# EasyEDA schematic SCH_Wack-a-Mole_2025-09-20.json
TITLE: Sheet_1; REV: 1.0; Date: 2025-09-12; Sheet: 1/1; Drawn By: ofer.afik123; Company: Your Company
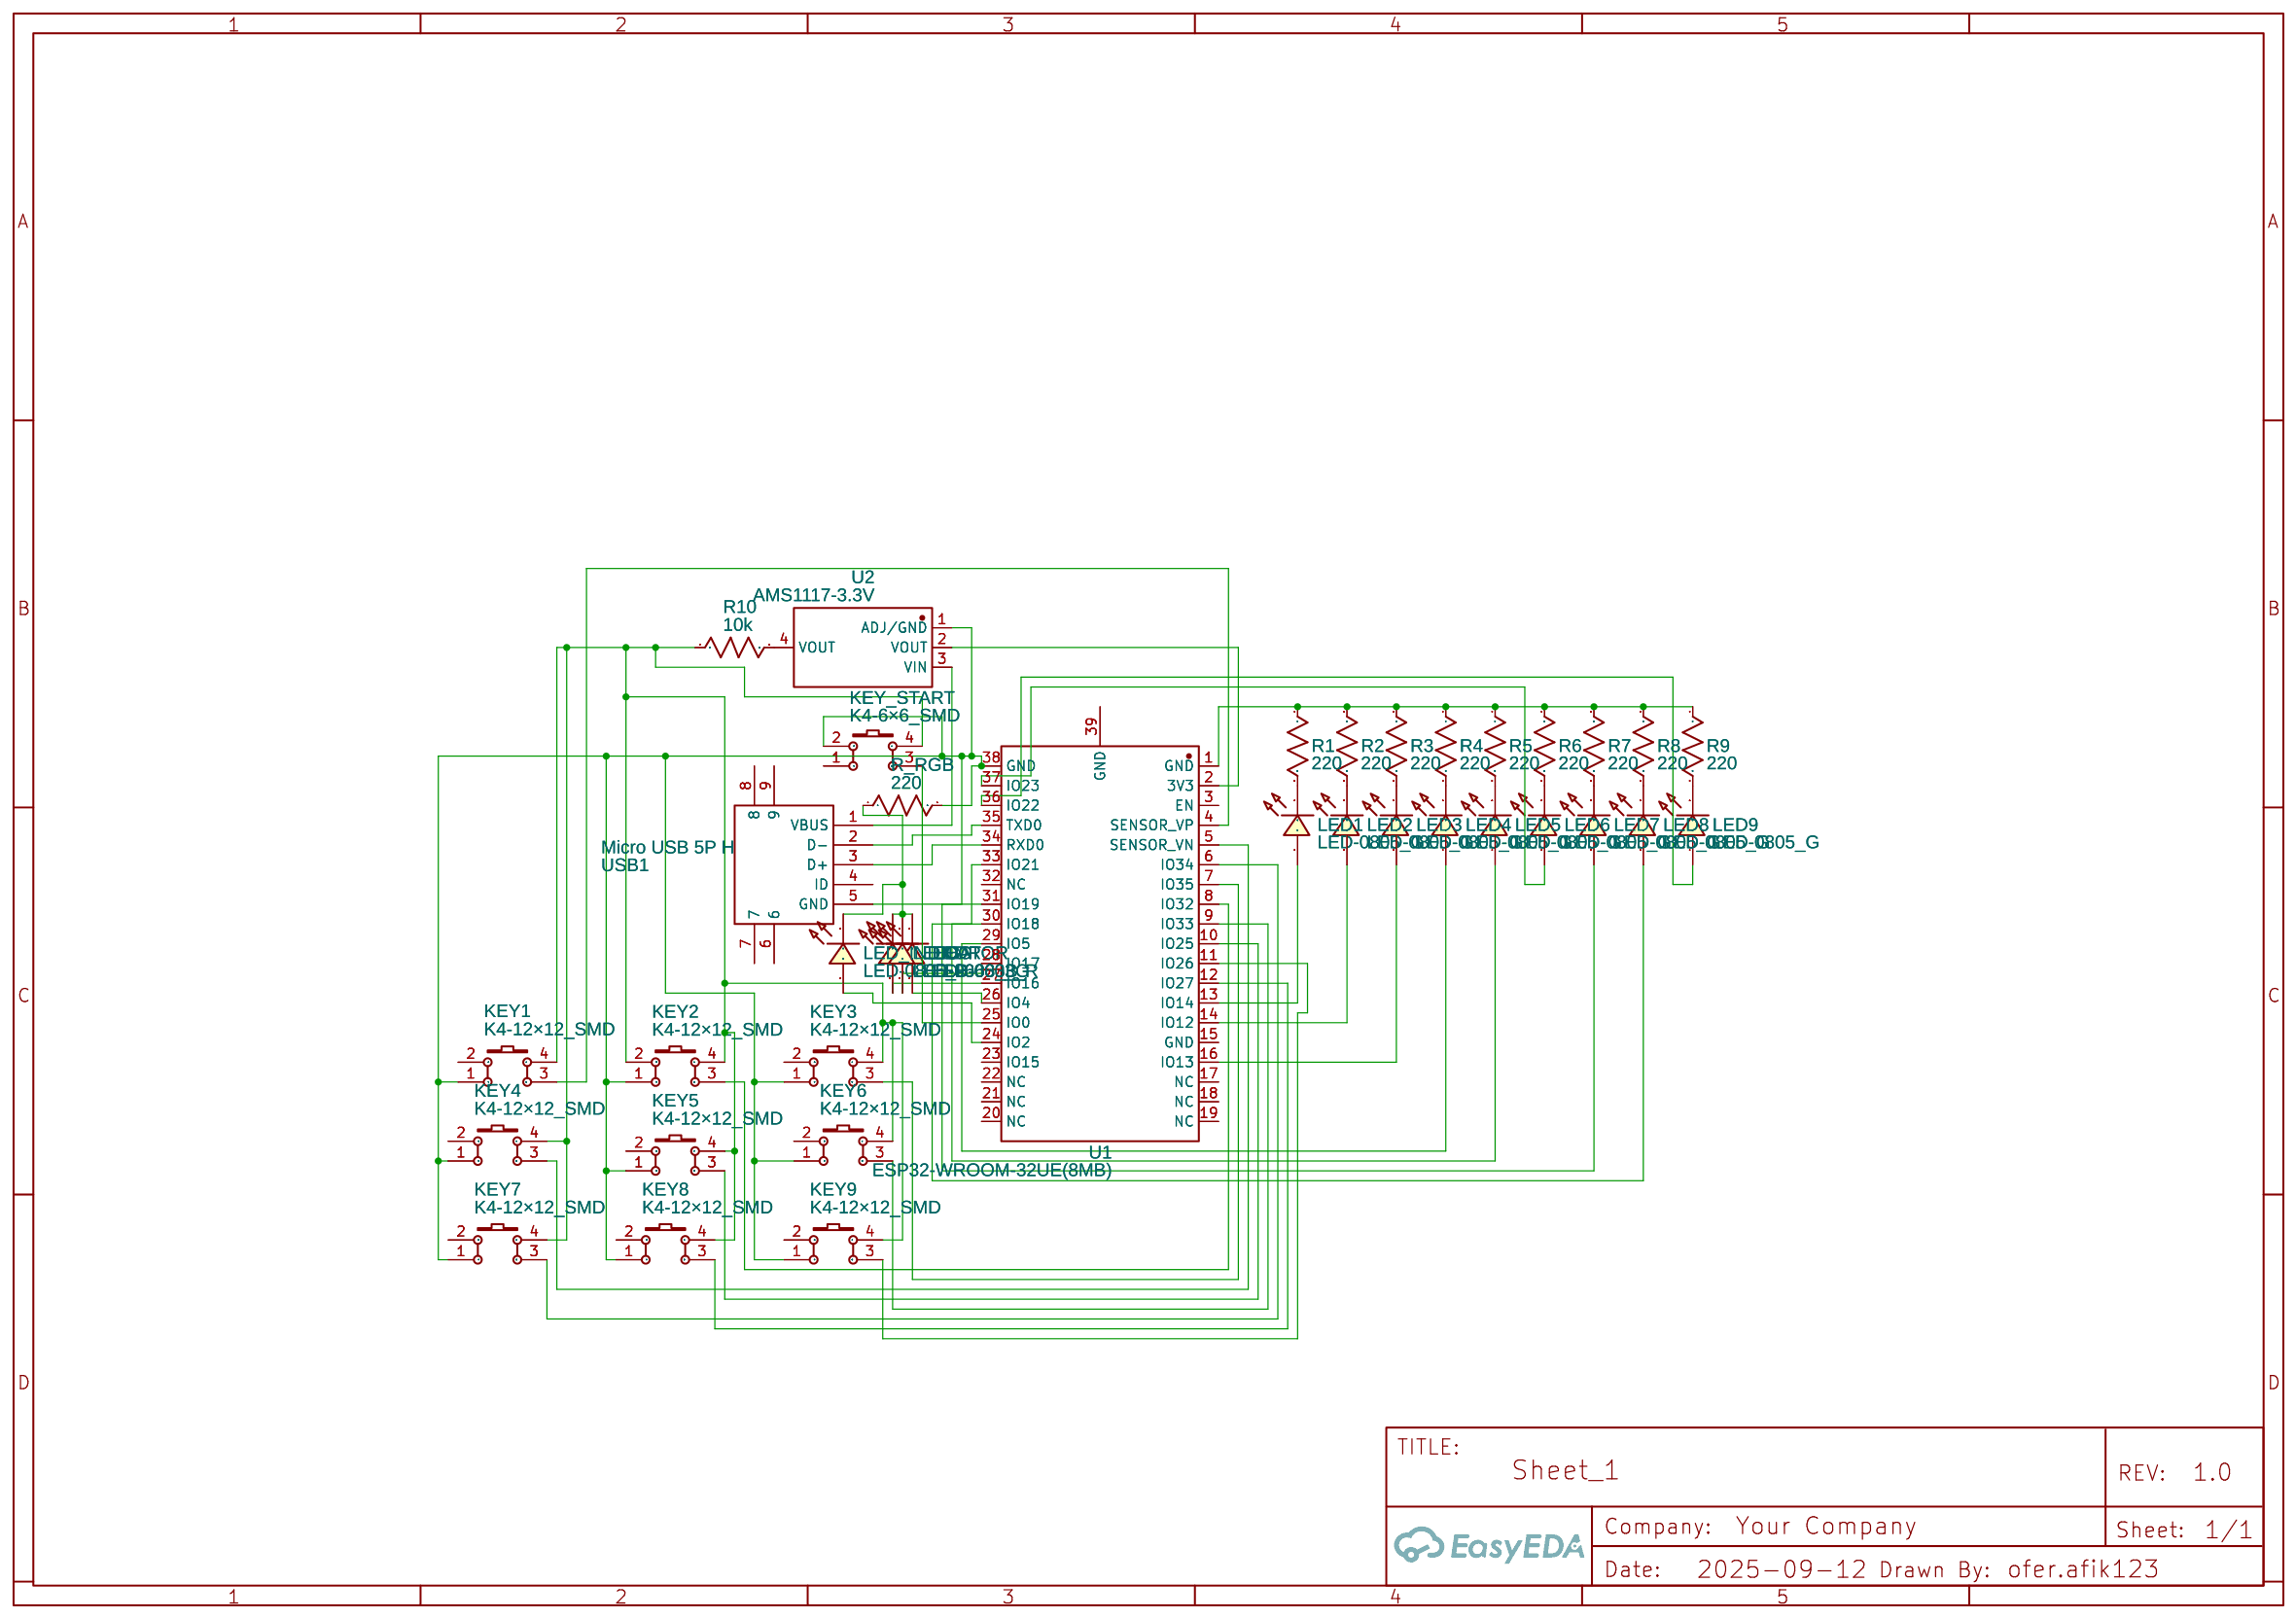
[diagram p0: schematic sheet]

## Parts
KEY1  K4-12×12_SMD  [KEY-SMD_4P-L12.0-W12.0-P5.00-LS15.2]
KEY2  K4-12×12_SMD  [KEY-SMD_4P-L12.0-W12.0-P5.00-LS15.2]
KEY3  K4-12×12_SMD  [KEY-SMD_4P-L12.0-W12.0-P5.00-LS15.2]
KEY4  K4-12×12_SMD  [KEY-SMD_4P-L12.0-W12.0-P5.00-LS15.2]
KEY5  K4-12×12_SMD  [KEY-SMD_4P-L12.0-W12.0-P5.00-LS15.2]
KEY6  K4-12×12_SMD  [KEY-SMD_4P-L12.0-W12.0-P5.00-LS15.2]
KEY7  K4-12×12_SMD  [KEY-SMD_4P-L12.0-W12.0-P5.00-LS15.2]
KEY8  K4-12×12_SMD  [KEY-SMD_4P-L12.0-W12.0-P5.00-LS15.2]
KEY9  K4-12×12_SMD  [KEY-SMD_4P-L12.0-W12.0-P5.00-LS15.2]
KEY_START  K4-6×6_SMD  [KEY-SMD_4P-L6.0-W6.0-P3.90-LS10.0]
LED1  LED-0805_G  [LED0805_GREEN]
LED2  LED-0805_G  [LED0805_GREEN]
LED3  LED-0805_G  [LED0805_GREEN]
LED4  LED-0805_G  [LED0805_GREEN]
LED5  LED-0805_G  [LED0805_GREEN]
LED6  LED-0805_G  [LED0805_GREEN]
LED7  LED-0805_G  [LED0805_GREEN]
LED8  LED-0805_G  [LED0805_GREEN]
LED9  LED-0805_G  [LED0805_GREEN]
LED_INDICATOR  LED-0805_B  [LED0805_BLUE]
LEDB  LED-0603_B  [LED0603_BLUE]
LEDG  LED-0603_G  [LED0603_GREEN]
LEDR  LED-0603_R  [LED0603_RED]
R1  220  [R0402]
R2  220  [R0402]
R3  220  [R0402]
R4  220  [R0402]
R5  220  [R0402]
R6  220  [R0402]
R7  220  [R0402]
R8  220  [R0402]
R9  220  [R0402]
R10  10k  [R0402]
R_RGB  220  [R0201]
U1  ESP32-WROOM-32UE(8MB)  [WIFI-SMD_ESP32-WROOM-32UE]
U2  AMS1117-3.3V  [SOT-223-4_L6.5-W3.5-P2.30-LS7.0-BR]
USB1  Micro USB 5P H  [MICRO-USB_MICRO-USB-30]

## Library data of the parts
KEY1-KEY9 = K4-12×12_SMD: Supplier Part: C136697; Supplier: LCSC; Manufacturer: 韩国韩荣; Manufacturer Part: K2-1103SP-E4SW-04; Contributor: LCEDA_Lib
KEY_START = K4-6×6_SMD: Supplier Part: C191626; Supplier: LCSC; Manufacturer: 韩国韩荣; Manufacturer Part: K2-6639SP-D4SC-04; Contributor: LCEDA_Lib
LED1-LED9 = LED-0805_G: Manufacturer: 国星光电; Manufacturer Part: NCD0805G1; Supplier Part: C84260; Contributor: LCEDA_Lib
LED_INDICATOR = LED-0805_B: Manufacturer: 方舟 ARKLED; Manufacturer Part: D-B080508B1-KS2; Supplier Part: C108412; Contributor: LCEDA_Lib
LEDB = LED-0603_B: Manufacturer: EVERLIGHT(台湾亿光); Manufacturer Part: 19-217/BHC-ZL1M2RY/3T; Supplier Part: C72041; Supplier: LCSC; Contributor: LCEDA_01
LEDG = LED-0603_G: Manufacturer: EVERLIGHT(台湾亿光); Manufacturer Part: 19-217/GHC-YR1S2/3T; Supplier Part: C72043; Supplier: LCSC; Contributor: LCEDA_Lib
LEDR = LED-0603_R: Manufacturer: EVERLIGHT(台湾亿光); Manufacturer Part: 19-217/R6C-AL1M2VY/3T; Supplier Part: C72044; Supplier: LCSC; Contributor: LCEDA_01
R1-R10 = R_0402_US: Contributor: LCEDA_Lib
R_RGB = R_0201_US: Contributor: LCEDA_Lib
U1 = ESP32-WROOM-32UE(8MB): Contributor: LCSC; Supplier: LCSC; Supplier Part: C701345; Manufacturer: ESPRESSIF(乐鑫); Manufacturer Part: ESP32-WROOM-32UE-N8; JLCPCB Part Class: Extended Part
U2 = AMS1117-3.3V: Contributor: LCSC; Supplier: LCSC; Supplier Part: C2688239; Manufacturer: WPMtek(维攀); JLCPCB Part Class: Extended Part
USB1 = Micro USB 5P H: Contributor: LCSC; Supplier: LCSC; Supplier Part: C40946; Manufacturer: 精拓金; Manufacturer Part: 920-E52A2021S10101; JLCPCB Part Class: Extended Part

## Nets
Net-(KEY1-1): KEY1.1 KEY2.1 KEY3.1 KEY4.1 KEY5.1 KEY6.1 KEY7.1 KEY8.1 KEY9.1 KEY_START.2 R_RGB.2 U1.38(GND) U2.1(ADJ/GND) USB1.5(GND)
Net-(KEY1-3): KEY1.3 U1.4(SENSOR_VP)
Net-(KEY1-4): KEY1.4 KEY2.2 KEY2.4 KEY3.4 KEY4.4 KEY5.4 KEY6.4 KEY7.4 KEY8.4 KEY9.4 KEY_START.4 R10.1
Net-(KEY2-3): KEY2.3 U1.8(IO32)
Net-(KEY3-3): KEY3.3 U1.7(IO35)
Net-(KEY4-3): KEY4.3 U1.5(SENSOR_VN)
Net-(KEY5-3): KEY5.3 U1.10(IO25)
Net-(KEY6-3): KEY6.3 U1.9(IO33)
Net-(KEY7-3): KEY7.3 U1.6(IO34)
Net-(KEY8-3): KEY8.3 U1.12(IO27)
Net-(KEY9-3): KEY9.3 U1.11(IO26)
Net-(KEY_START-3): KEY_START.3 U1.25(IO0)
Net-(LED1-1): LED1.1 U1.13(IO14)
Net-(LED1-2): LED1.2 R1.2
Net-(LED2-1): LED2.1 U1.14(IO12)
Net-(LED2-2): LED2.2 R2.2
Net-(LED3-1): LED3.1 U1.16(IO13)
Net-(LED3-2): LED3.2 R3.2
Net-(LED4-1): LED4.1 U1.29(IO5)
Net-(LED4-2): LED4.2 R4.2
Net-(LED5-1): LED5.1 U1.33(IO21)
Net-(LED5-2): LED5.2 R5.2
Net-(LED6-1): LED6.1 U1.37(IO23)
Net-(LED6-2): LED6.2 R6.2
Net-(LED7-1): LED7.1 U1.31(IO19)
Net-(LED7-2): LED7.2 R7.2
Net-(LED8-1): LED8.1 U1.30(IO18)
Net-(LED8-2): LED8.2 R8.2
Net-(LED9-1): LED9.1 U1.36(IO22)
Net-(LED9-2): LED9.2 R9.2
Net-(LED_INDICATOR-1): LED_INDICATOR.1 U1.24(IO2)
Net-(LED_INDICATOR-2): LED_INDICATOR.2 LEDB.2 LEDG.2 LEDR.2 R_RGB.1
Net-(LEDB-1): LEDB.1 U1.27(IO16)
Net-(LEDG-1): LEDG.1 U1.28(IO17)
Net-(LEDR-1): LEDR.1 U1.26(IO4)
Net-(R1-1): R1.1 R2.1 R3.1 R4.1 R5.1 R6.1 R7.1 R8.1 R9.1 U1.1(GND)
Net-(R10-2): R10.2 U2.4(VOUT)
Net-(U1-2): U1.2(3V3) U2.2(VOUT)
Net-(U1-34): U1.34(RXD0) USB1.3(D+)
Net-(U1-35): U1.35(TXD0) USB1.2(D-)
Net-(U2-3): U2.3(VIN) USB1.1(VBUS)

Not connected (* = marked no-connect by the designer): KEY1 2; KEY3 2; KEY4 2; KEY5 2; KEY6 2; KEY7 2; KEY8 2; KEY9 2; KEY_START 1; U1 3(EN) 15(GND) 17(NC) 18(NC) 19(NC) 20(NC) 21(NC) 22(NC) 23(IO15) 32(NC) 39(GND); USB1 4(ID) 6 7 8 9
